# EAGLE design The Flying Jalapeno PB v01 (EAGLE 7.3.0)
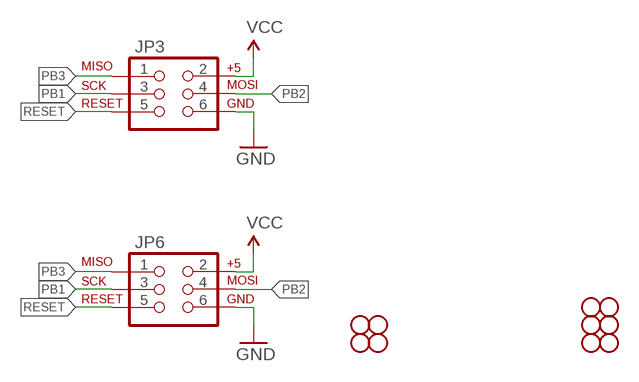
[diagram p0: schematic, sheet 1]

## Parts
JP3  AVR_SPI_PRG_6PTH  [2X3]
JP6  AVR_SPI_PRG_6PTH  [2X3]
STANDOFF1  STAND-OFFTIGHT  [STAND-OFF-TIGHT]
STANDOFF2  STAND-OFFTIGHT  [STAND-OFF-TIGHT]
STANDOFF3  STAND-OFFTIGHT  [STAND-OFF-TIGHT]
STANDOFF4  STAND-OFFTIGHT  [STAND-OFF-TIGHT]
STANDOFF5  STAND-OFFTIGHT  [STAND-OFF-TIGHT]
STANDOFF6  STAND-OFFTIGHT  [STAND-OFF-TIGHT]
STANDOFF7  STAND-OFFTIGHT  [STAND-OFF-TIGHT]
STANDOFF8  STAND-OFFTIGHT  [STAND-OFF-TIGHT]
STANDOFF9  STAND-OFFTIGHT  [STAND-OFF-TIGHT]
STANDOFF10  STAND-OFFTIGHT  [STAND-OFF-TIGHT]

## Nets
GND: JP3.6 JP6.6
PB1: JP3.3 JP6.3
PB2: JP3.4 JP6.4
PB3: JP3.1 JP6.1
RESET: JP3.5 JP6.5
VCC [POWER]: JP3.2 JP6.2

## Library data of the parts
JP3 JP6 = SparkFun:AVR_SPI_PRG_6: AVR ISP 6 Pin This is the reduced ISP connector for AVR programming. Common on Arduino. This footprint will take up less PCB space and can be used with a 10-pin to 6-pin adapter such as SKU: BOB-08508
STANDOFF1-STANDOFF10 = SparkFun-Electromechanical:STAND-OFF: #4 Stand Off This is the mechanical footprint for a #4 phillips button head screw. Use the keepout ring to avoid running the screw head into surrounding components. SKU : PRT-00447

## Net classes
0 default: width 0.203 mm
1 BIG: width 0.203 mm
2 POWER: width 0.203 mm

## Board
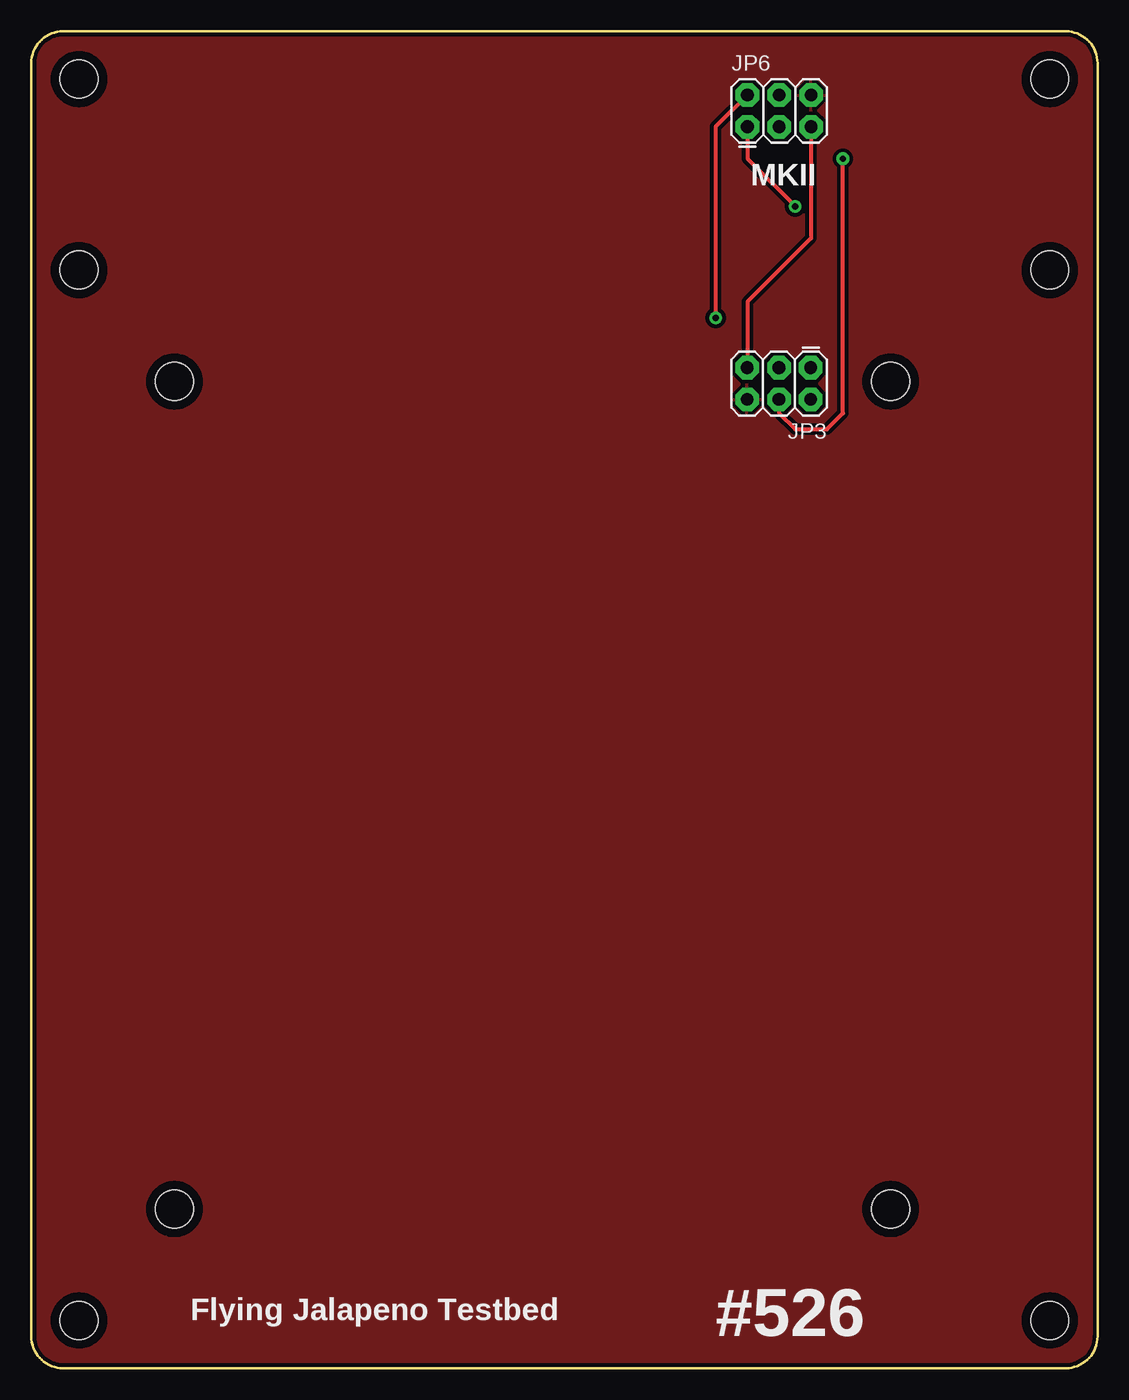
[diagram p1: board, top side]
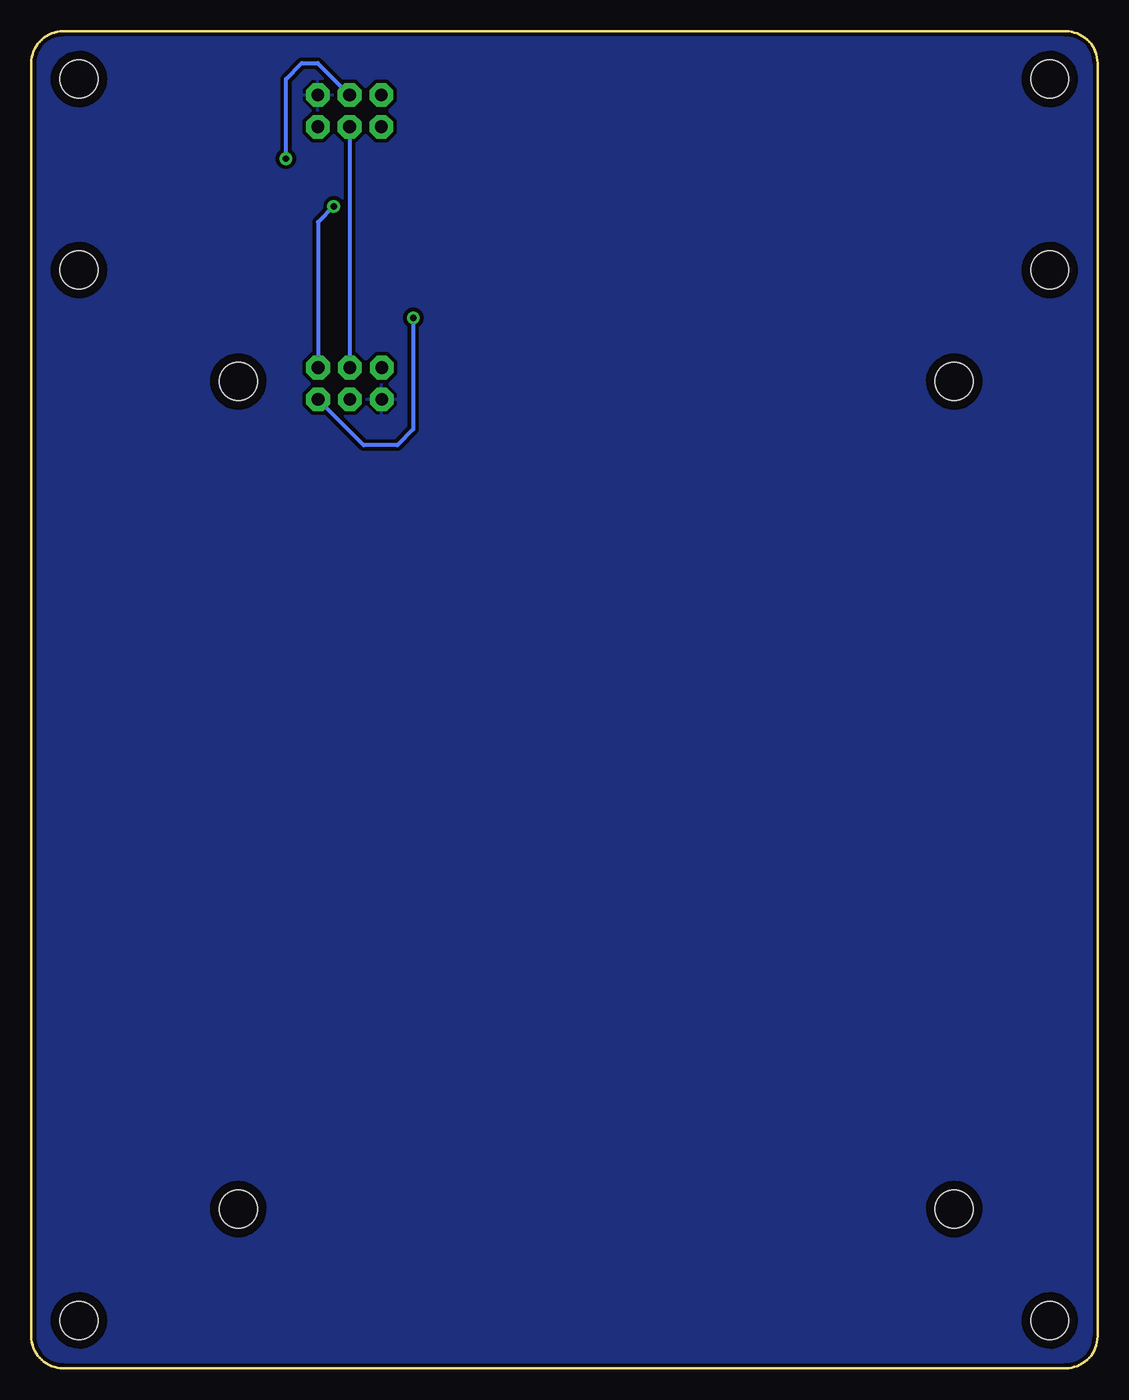
[diagram p2: board, bottom side, seen from below]

Size 85.09 x 106.68 mm. Coordinates in mm from the lower left corner, seen from the top.
Outline: 2.54,0 arc-90 0,2.54 0,104.14 arc-90 2.54,106.68 82.55,106.68 arc-90 85.09,104.14 85.09,2.54 arc-90 82.55,0 2.54,0
Copper layers (1*16): Top 0.035mm / dielectric 1.5mm / Bottom 0.035mm
Design rules "SparkFun *": minimum track width 7mil, minimum drill 15mil, track to track 8mil, track to pad 8mil, pad to pad 8mil, via to via 8mil, smd to smd 8mil, copper to edge 8mil, drill to drill 8mil, minimum pad ring 10mil, minimum via ring 10mil, stop-mask expansion 4mil, vias tented up to drill 20mil, thermal gap 10mil

### Footprints (pad centres in the part's own frame; a part is rotated, then mirrored left to right if it is on the bottom)
2X3 = drill 1.016 pad 1.88 octagon: 1 0,0; 2 0,2.54; 3 2.54,0; 4 2.54,2.54; 5 5.08,0; 6 5.08,2.54
STAND-OFF-TIGHT = hole 3.048: 0,0

### Placement (x,y rotation side)
JP3  62.2,79.84 180 top
JP6  57.15,99.06 0 top
STANDOFF1  68.58,12.7 90 top
STANDOFF2  68.58,78.74 90 top
STANDOFF3  11.43,78.74 90 top
STANDOFF4  11.43,12.7 90 top
STANDOFF5  81.28,3.81 0 top
STANDOFF6  3.81,3.81 0 top
STANDOFF7  81.28,102.87 0 top
STANDOFF8  3.81,102.87 0 top
STANDOFF9  3.81,87.63 0 top
STANDOFF10  81.28,87.63 0 top

### Tracks (layer width: path | path; a pad name or v marks a point on that pad's centre or on a via)
GND
  pour Bottom (isolate 0.305): 85.09,0 85.09,106.68 0,106.68 0,0
  pour Top (isolate 0.305): 85.09,0 0,0 0,106.68 85.09,106.68
PB1
  Bottom 0.305: JP6.3 59.69,79.87 JP3.3
PB2  (via drill 0.51)
  Top 0.305: JP3.4 59.66,76.22 60.96,74.93 63.5,74.93 64.77,76.2 v64.77,96.52
  Bottom 0.305: v64.77,96.52 64.77,102.87 63.5,104.14 62.23,104.14 JP6.4
PB3  (via drill 0.51)
  Top 0.305: JP6.1 57.15,96.52 v60.96,92.71
  Bottom 0.305: v60.96,92.71 62.2,91.47 JP3.1
RESET
  Top 0.305: JP6.5 62.23,90.17 57.15,85.09 57.15,79.87 JP3.5
VCC  (via drill 0.51)
  Top 0.305: JP6.2 54.61,99.06 v54.61,83.82
  Bottom 0.305: v54.61,83.82 54.61,74.93 55.88,73.66 58.56,73.66 JP3.2

### Text on the board
tPlace: MKII | Flying Jalapeno Testbed | #526
Reference: RESET | 0.1uF | 10K | GRN | D52 | D53 | 10K | BSS138 | 22M | D50 | D51 | 0.1uF | D30 | CS2 | 10K | 10K | 16MHz | The Flying Jalapeno | D28 | D29 | BSS138 | D26 | D27 | Optional I2C pullups | D24 | D25 | 10K | STAT | D22 | D23 | SERIAL COM | SDA | SCL | BLK | 390 | Tx1 | Rx1 | (For Spicy Testbeds) | Tx2 | Rx2 | Tx3 | Rx3 | 10uF | 5V | D12 | D13 | 0.1uF | VCC | MEGA2560 | D10 | D11 | V01 | 3.3V | D8 | D9 | 0.1uF | 10K | D6 | D7 | 10uF | Testbed # | LM1117 | 0.1uF | D4 | D5 | 100K | D2 | D3 | A11 | A12 | A9 | A10 | A7 | A8 | 390 | 715 | A5 | A6 | POWER | 470 | 100 | 10uF | A3 | A4 | 390 | 240 | 100 | 100uF | 470 | V2 | 22M | 390 | 390 | 390 | 390 | A1 | A2 | 0.1uF | PT | A0 | LM1117 | PASS | VREG2 | npn | PASS | PT | 10uF | FAIL | V2 | 100K | 10K | CS1 | 390 | P-MOSFET | FAIL | RAW | 10K | 10K | 0.1uF | RAW | RAW | 10uF | 100 | 100uF | V2 | V2 | 715 | 240 | V1 | 390 | 10K | V1 | V1 | 0.1uF | 100K | GND | GNd | VOLTAGE | MBRA140 | LM1117 | BYPASS / PTC | VREG1 | npn | 10K | V1 | 0.1uF | 390 | P-MOSFET | PTC | RAW | 10K | 10uF